# Altium project LLN-24VDimmer.PrjPcb
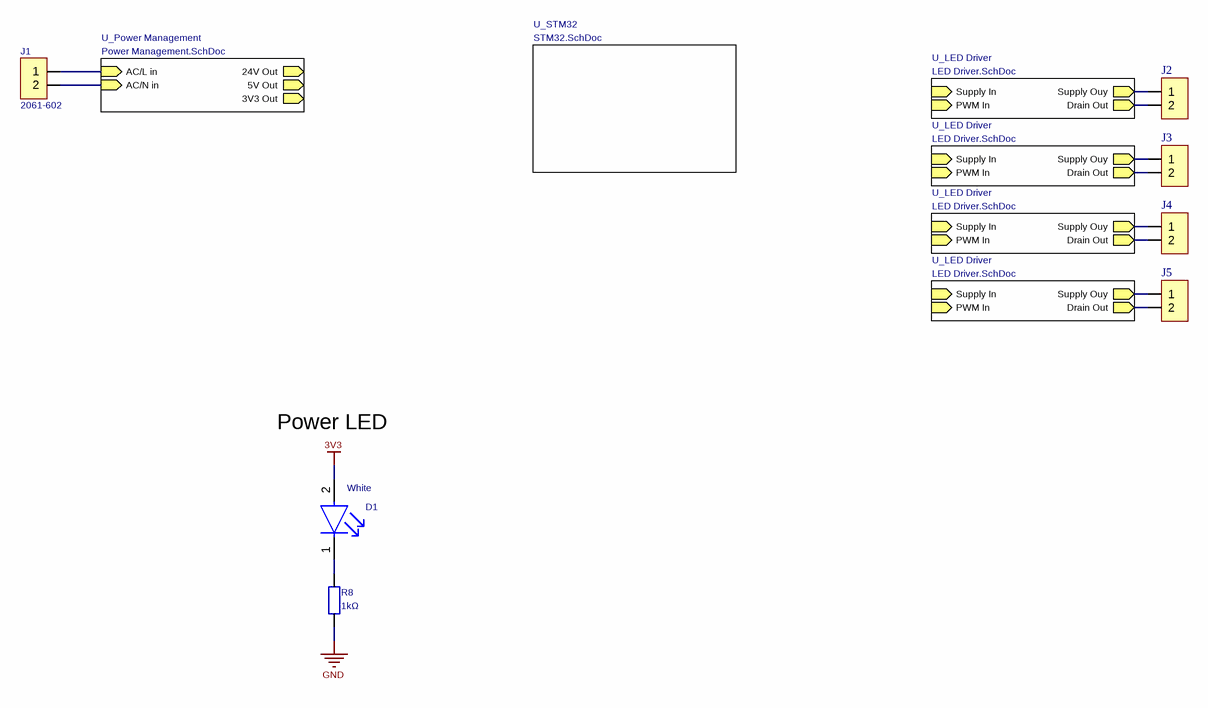
[diagram p0: LLN-24VDimmer.SchDoc]
address1: Drachmeweg 111; address2: 2153PA Nieuw-Vennep; CompanyName: Mayht; DrawnBy: David; HWRev: 0.9.0; Project: Mayhtier V0.9.0
4 sheets, 79 parts. Net scope: hierarchical (ports join the sheet entries above them; power ports are global).
Board file: LLN-24VDimmer.PcbDoc
Sheets:
  LLN-24VDimmer.SchDoc
    U_STM32 = STM32.SchDoc
    U_Power Management = Power Management.SchDoc
    U_LED Driver = LED Driver.SchDoc
    U_LED Driver = LED Driver.SchDoc
    U_LED Driver = LED Driver.SchDoc
    U_LED Driver = LED Driver.SchDoc

## Sheet LLN-24VDimmer.SchDoc: Overview
size A3; CompanyName: Mayht; DrawnBy: David; Organization: Mayht; Address1: Drachmeweg 111; Address2: 2153PA Nieuw-Vennep; DocumentNumber: 1; Revision: 1.0; SheetNumber: 1; SheetTotal: 4

### Parts
(Parts that share a designator on the sheet are numbered #1, #2 ... from top to bottom, then left to right.)
D1#1  value White  [LEDC1608X08N]
J1  MPN: 2061-602  [WAGO_2061-602/998-404]
J2  (no value)  [WAGO_2060-452/998-404]
J3  (no value)  [WAGO_2060-452/998-404]
J4  (no value)  [WAGO_2060-452/998-404]
J5  (no value)  [WAGO_2060-452/998-404]
R8  value 1kΩ  [RESC1005X04N]

### Sub-sheets
U_LED Driver = LED Driver.SchDoc: PWM In (in), Drain Out (out), Supply Ouy (out), Supply In (in)
U_LED Driver = LED Driver.SchDoc: PWM In (in), Drain Out (out), Supply Ouy (out), Supply In (in)
U_LED Driver = LED Driver.SchDoc: PWM In (in), Drain Out (out), Supply Ouy (out), Supply In (in)
U_LED Driver = LED Driver.SchDoc: PWM In (in), Drain Out (out), Supply Ouy (out), Supply In (in)
U_Power Management = Power Management.SchDoc: 5V Out (out), 3V3 Out (out), 24V Out (out), AC/L in (in), AC/N in (in)
U_STM32 = STM32.SchDoc: no entries

### Nets
3V3: D1#1.2(A)
GND: R8.2
NetC1_U_LED_Driver#1_2: J2.1 ; sheet U_LED Driver/Supply Ouy
NetC1_U_LED_Driver#2_2: J3.1 ; sheet U_LED Driver/Supply Ouy
NetC1_U_LED_Driver#3_2: J4.1 ; sheet U_LED Driver/Supply Ouy
NetC1_U_LED_Driver#4_2: J5.1 ; sheet U_LED Driver/Supply Ouy
NetD1#1_1: D1#1.1(C) R8.1
NetD5_U_LED_Driver#1_1: J2.2 ; sheet U_LED Driver/Drain Out
NetD5_U_LED_Driver#2_1: J3.2 ; sheet U_LED Driver/Drain Out
NetD5_U_LED_Driver#3_1: J4.2 ; sheet U_LED Driver/Drain Out
NetD5_U_LED_Driver#4_1: J5.2 ; sheet U_LED Driver/Drain Out
NetF4_1: J1.1 ; sheet U_Power Management/AC/L in
NetJ1_2: J1.2 ; sheet U_Power Management/AC/N in

### Notes on the sheet
- Power LED
- Redako
- Keilestraat 5a, 3029BP, Rotterdam, M: david@redako.nl, T: +31 6 16001008
- Project
- Title
- Customer
- Size:
- Date:
- File:
- A4
- Revision:
- Time:
- Drawn by:
- GIT Revision:
- Sheet:
- of

### Library data of the parts
D1#1 = CMP-22017-000005-1: LED; MPN: KT-0603W; Package: 0603
J1-J5 = JST_Connector_2Pin
R8 = Res: MPN: 0402WGF1001TCE; Package: 0402

## Sheet STM32.SchDoc: STM32
size A3; CompanyName: Mayht; DrawnBy: David; Organization: Mayht; Address1: Drachmeweg 111; Address2: 2153PA Nieuw-Vennep; DocumentNumber: 18; Revision: 1.0; SheetNumber: 3; SheetTotal: 4
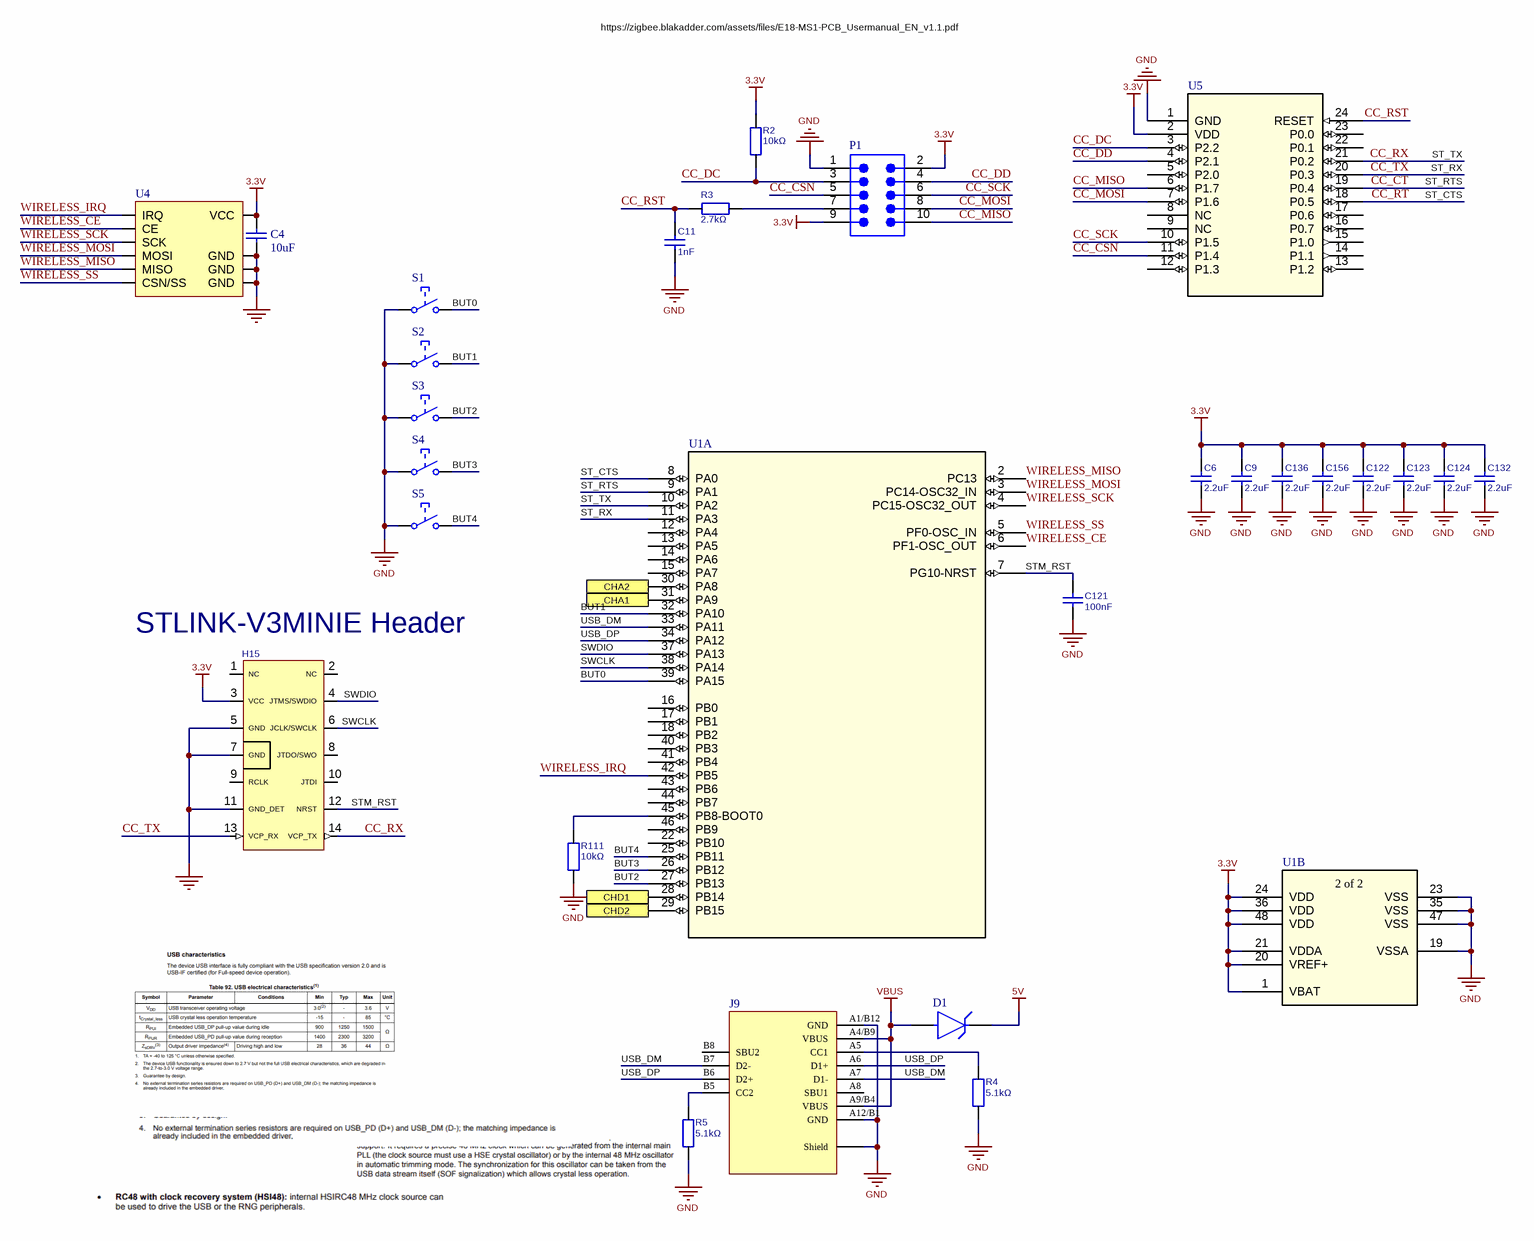
[diagram p1: STM32.SchDoc]

### Parts
(Parts that share a designator on the sheet are numbered #1, #2 ... from top to bottom, then left to right.)
C4  value 10uF  [CAPC1608X08N]
C6  value 2.2uF  [CAPC1005X05N]
C9  value 2.2uF  [CAPC1005X05N]
C11  value 1nF  [CAPC1005X05N]
C121  value 100nF  [CAPC1005X05N]
C122  value 2.2uF  [CAPC1005X05N]
C123  value 2.2uF  [CAPC1005X05N]
C124  value 2.2uF  [CAPC1005X05N]
C132  value 2.2uF  [CAPC1005X05N]
C136  value 2.2uF  [CAPC1005X05N]
C156  value 2.2uF  [CAPC1005X05N]
D1#2  (no value)  [SOD123]
H15  (no value)  [Header 2x7 [14] 1.27mm Male TH]
J9  (no value)  [USB4105-GF-A-Footprint-1]
P1  (no value)  [62201021121]
R2  value 10kΩ  [RESC1005X04N]
R3  value 2.7kΩ  [RESC1005X04N]
R4  value 5.1kΩ  [RESC1005X04N]
R5  value 5.1kΩ  [RESC1005X04N]
R111  value 10kΩ  [RESC1005X04N]
S1  (no value)  [SWITCH - 4x3 SMD - 2 pin]
S2  (no value)  [SWITCH - 4x3 SMD - 2 pin]
S3  (no value)  [SWITCH - 4x3 SMD - 2 pin]
S4  (no value)  [SWITCH - 4x3 SMD - 2 pin]
S5  (no value)  [SWITCH - 4x3 SMD - 2 pin]
U1  (no value)  [LQFP48-7x7mm]  (parts A,B of 2)
U4  (no value)  [E01-2G4M13S]
U5  (no value)  [E18-MS1-PCB_BYT]

### Ports
CHA1 (out), CHA2 (out), CHD1 (out), CHD2 (out)

### Nets
3.3V: C4.1 C6.2 C9.2 C122.2 C123.2 C124.2 C132.2 C136.2 C156.2 H15.3(VCC) P1.2 P1.9 R2.1 U1.1(VBAT) U1.20(VREF+) U1.21(VDDA) U1.24(VDD) U1.36(VDD) U1.48(VDD) U4.1(VCC) U5.2(VDD)
5V: D1#2.2(C)
GND: C4.2 C6.1 C9.1 C11.1 C121.1 C122.1 C123.1 C124.1 C132.1 C136.1 C156.1 H15.5(GND) H15.7(GND) H15.11(GND_DET) J9.A1/B12(GND) J9.A12/B1(GND) J9.MNT(Shield) P1.1 R4.2 R5.2 R111.2 S1.1 S2.1 S3.1 S4.1 S5.1 U1.19(VSSA) U1.23(VSS) U1.35(VSS) U1.47(VSS) U4.8(GND) U4.9(GND) U4.10(GND) U5.1(GND)
VBUS: D1#2.1(A) J9.A4/B9(VBUS) J9.A9/B4(VBUS)
BUT0: S1.2 U1.39(PA15)
BUT1: S2.2 U1.32(PA10)
BUT2: S3.2 U1.27(PB13)
BUT3: S4.2 U1.26(PB12)
BUT4: S5.2 U1.25(PB11)
CC_CSN: P1.5 U5.11(P1.4)
CC_CT: U1.9(PA1) U5.19(P0.4)  [also labelled ST_RTS]
CC_DC: P1.3 R2.2 U5.3(P2.2)
CC_DD: P1.4 U5.4(P2.1)
CC_MISO: P1.10 U5.6(P1.7)
CC_MOSI: P1.8 U5.7(P1.6)
CC_RST: C11.2 R3.2 U5.24(RESET)
CC_RT: U1.8(PA0) U5.18(P0.5)  [also labelled ST_CTS]
CC_RX: H15.14(VCP_TX) U1.10(PA2) U5.21(P0.2)  [also labelled ST_TX]
CC_SCK: P1.6 U5.10(P1.5)
CC_TX: H15.13(VCP_RX) U1.11(PA3) U5.20(P0.3)  [also labelled ST_RX]
STM_RST: C121.2 H15.12(NRST) U1.7(PG10-NRST)
SWCLK: H15.6(JCLK/SWCLK) U1.38(PA14)
SWDIO: H15.4(JTMS/SWDIO) U1.37(PA13)
USB_DM: J9.A7(D1-) J9.B7(D2-) U1.33(PA11)
USB_DP: J9.A6(D1+) J9.B6(D2+) U1.34(PA12)
WIRELESS_CE: U1.6(PF1-OSC_OUT) U4.2(CE)
WIRELESS_IRQ: U1.42(PB5) U4.7(IRQ)
WIRELESS_MISO: U1.2(PC13) U4.6(MISO)
WIRELESS_MOSI: U1.3(PC14-OSC32_IN) U4.5(MOSI)
WIRELESS_SCK: U1.4(PC15-OSC32_OUT) U4.4(SCK)
WIRELESS_SS: U1.5(PF0-OSC_IN) U4.3(CSN/SS)
NetJ9_A5: J9.A5(CC1) R4.1
NetJ9_B5: J9.B5(CC2) R5.1
NetP1_7: P1.7 R3.1
NetR111_1: R111.1 U1.45(PB8-BOOT0)
NetU1_28: U1.28(PB14) ; port CHD1
NetU1_29: U1.29(PB15) ; port CHD2
NetU1_30: U1.30(PA8) ; port CHA2
NetU1_31: U1.31(PA9) ; port CHA1

Not connected (* = marked no-connect by the designer): H15 1(NC) 2(NC) 8(JTDO/SWO) 9(RCLK) 10(JTDI); J9 A8(SBU1) B8(SBU2); U1 12(PA4) 13(PA5) 14(PA6) 15(PA7) 16(PB0) 17(PB1) 18(PB2) 22(PB10) 40(PB3) 41(PB4) 43(PB6) 44(PB7) 46(PB9); U5 5(P2.0) 8(NC) 9(NC) 12(P1.3) 13(P1.2) 14(P1.1) 15(P1.0) 16(P0.7) 17(P0.6) 22(P0.1) 23(P0.0)

### Notes on the sheet
- https://zigbee.blakadder.com/assets/files/E18-MS1-PCB_Usermanual_EN_v1.1.pdf
- (near H15) STLINK-V3MINIE Header
- Redako
- Keilestraat 5a, 3029BP, Rotterdam, M: david@redako.nl, T: +31 6 16001008
- Project
- Title
- Customer
- Size:
- Date:
- File:
- A4
- Revision:
- Time:
- Drawn by:
- GIT Revision:
- Sheet:
- of
- (in symbol STM32G474CBT6TR, part B) 2 of 2

### Library data of the parts
C4 C6 C9 C11 C122-C124 C132 C136 C156 = SMD_Cap
  C4: Package: 0603
  C6 C9 C11 C122-C124 C132 C136 C156: Package: 0402
C121 = SMD_Cap: Manufacturer: Samsung; MPN: CL05B104KB54PNC; Type: X7R; Rating: 50V; Tolerance: ±10%; Package: 0402; JLC Part Type: Basic; JLCPCB Part #: C307331
D1#2 = f813f71cba58e380607f5dd3caf9714: BZT52C20-7-F BZT52C20 Series 20 V 10 mA 500 mW Surface Mount Zener Diode - SOD-123; MPN: B5819W SL; Package: SOD-123; JLCPCB Part #: C8598
H15 = STLINK-V3MINIE_14P_TH: MPN: DW127R-22-14-23
J9 = USB C USB4105-GF-A-120: Manufacturer: Sofng; MPN: MC-311D; Package: SMD; JLCPCB Part #: C136423
P1 = CMP-1502-00948-3: MPN: 1271WV-2x5P
R2 R111 = Res: MPN: 0402WGF1002TCE; Manufacturer: Uniroyal; Rating: 50V; Tolerance: ±1%; Package: 0402; JLC Part Type: Basic; JLCPCB Part #: C25744
R3-R5 = Res: Manufacturer: Uniroyal; Rating: 50V; Tolerance: ±1%; Package: 0402
S1-S5 = TS-1088R-02026: SPST 50MA @ 12VDC VERTICAL ROUND BUTTON 260GF SMD,3X4X2.0MM TACTILE SWITCHES ROHS; Manufacturer: XUNPU; Value: 50mA, 12VDC; MPN: TS-1088R-02026; Package: SMD,3x4x2.0mm; JLC Part Type: Extended; JLCPCB Part #: C455280
U1 = STM32G474CBT6TR: No Description Available; MPN: STM32G474CBT6TR
U4 = E01-ML01SP4: MPN: E01-2G4M13S
U5 = E18-MS1-PCB: No Description Available; MPN: E18-MS1-PCB

## Sheet Power Management.SchDoc: Power Management
size 287 x 198 mm; CompanyName: Mayht; DrawnBy: David; Organization: Mayht; Address1: Drachmeweg 111; Address2: 2153PA Nieuw-Vennep; DocumentNumber: 1; Revision: 1.0; SheetNumber: 2; SheetTotal: 4
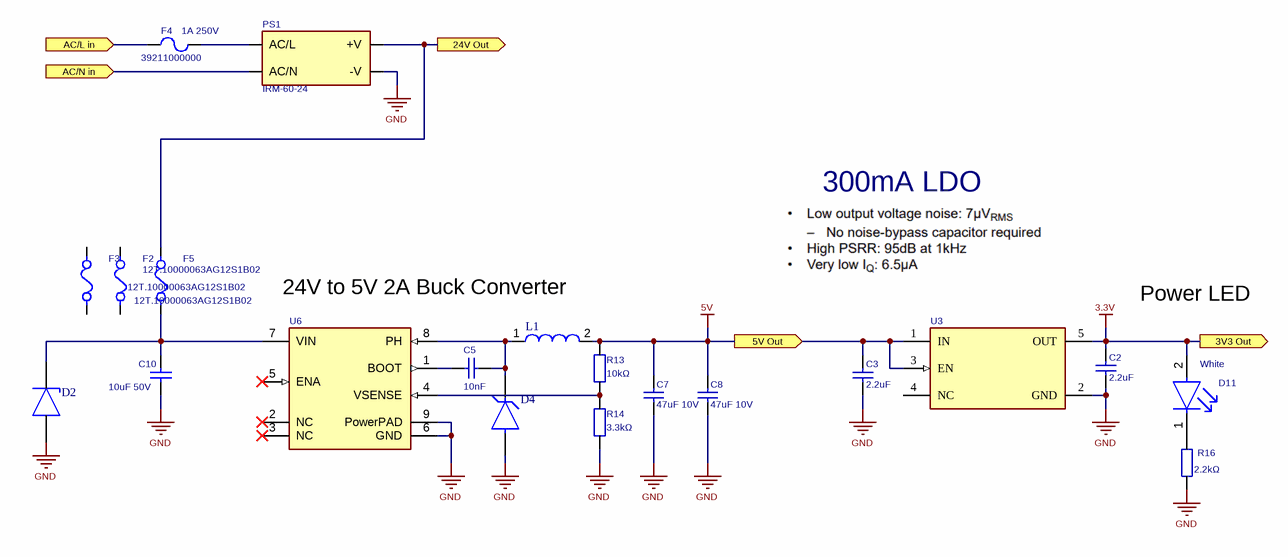
[diagram p2: Power Management.SchDoc]

### Parts
C2  value 2.2uF  [CAPC1005X05N]
C3  value 2.2uF  [CAPC1005X05N]
C5  value 10nF  [CAPC1005X05N]
C7  value 47uF 10V  [CAPC3216X16N]
C8  value 47uF 10V  [CAPC3216X16N]
C10  value 10uF 50V  [CAPC3216X16N]
D2  (no value)  [SOD-123FL]
D4  (no value)  [SOD-123]
D11  value White  [LEDC1608X08N]
F2  MPN: 12T.10000063AG12S1B02  [FP-SF-1206S-IPC_B]
F3  MPN: 12T.10000063AG12S1B02  [FP-SF-1206S-IPC_B]
F4  value 1A 250V  MPN: 39211000000  [FUS_LITTELFUSE_392_LTF]
F5  MPN: 12T.10000063AG12S1B02  [FP-SF-1206S-IPC_B]
L1  (no value)  [SWPA6054A]
PS1  (no value)  [IRM-60-24]
R13  value 10kΩ  [RESC1005X04N]
R14  value 3.3kΩ  [RESC1005X04N]
R16  value 2.2kΩ  [RESC1005X04N]
U3  (no value)  [FP-DBV0005A-MFG]
U6  (no value)  [FP-DDA0008J-MFG]

### Ports
3V3 Out (out), 5V Out (out), 24V Out (out), AC/L in (in), AC/N in (in)

### Nets
3.3V: C2.2 D11.2(A) U3.5(OUT) ; port 3V3 Out
5V: C3.2 C7.1 C8.1 L1.2 R13.1 U3.1(IN) U3.3(EN) ; port 5V Out
GND: C2.1 C3.1 C7.2 C8.2 C10.1 D2.1(A) D4.A PS1.-V R14.2 R16.2 U3.2(GND) U6.6(GND) U6.9(PowerPAD)
NetC5_1: C5.1 U6.1(BOOT)
NetC5_2: C5.2 D4.K(C) L1.1 U6.8(PH)
NetC10_2: C10.2 D2.2(C) F5.1 U6.7(VIN)
NetD11_1: D11.1(C) R16.1
NetF4_1: F4.1 ; port AC/L in
NetF4_2: F4.2 PS1.AC/L
NetF5_2: F5.2 PS1.+V ; port 24V Out
NetJ1_2: PS1.AC/N ; port AC/N in
NetR13_2: R13.2 R14.1 U6.4(VSENSE)

Not connected (* = marked no-connect by the designer): F2 1 2; F3 1 2; U3 4(NC); U6 2(NC)* 3(NC)* 5(ENA)*

### Notes on the sheet
- 300mA LDO
- 24V to 5V 2A Buck Converter
- Power LED
- Redako
- Keilestraat 5a, 3029BP, Rotterdam, M: david@redako.nl, T: +31 6 16001008
- Project
- Title
- Customer
- Size:
- Date:
- File:
- A4
- Revision:
- Time:
- Drawn by:
- GIT Revision:
- Sheet:
- of

### Library data of the parts
C2 C3 C5 = SMD_Cap: Package: 0402
C7 C8 = SMD_Cap: Rating: 10V; Package: 1206
C10 = CMP-2000-06048-1: Rating: 50V; Package: 1206
D2 = d386f69c7d770905792c16b93fa31a7: SMF24A-E3-08 Trans Voltage Suppressor Diode, 1000W, 24V V(RWM), Unidirectional, 1 Element, Silicon, DO-219AB; MPN: SMF24A
D4 = f813f71cba58e380607f5dd3caf9714: as D1#2 on sheet STM32; Package: SOD-123; JLCPCB Part #: C8598
D11 = CMP-22017-000005-1: LED; Package: 0603
F2 F3 F5 = CMP-07399-000003-1: FUSE BOARD MOUNT 1A 63VDC 1206; Package: 1206
F4 = FUSE-2: Manufacturer: Littelfuse; JLC Part Type: Extended; JLCPCB Part #: C99566
L1 = SWPA6045S101MT: 100uH ±20% 800mA 433mΩ SMD,6.0x6.0x4.5mm Power Inductors RoHS; MPN: SWPA6045S101MT; Package: SMD,6.0x6.0x4.5mm; JLC Part Type: Extended; JLCPCB Part #: C60633
PS1 = IRM-60-24: Enclosed AC DC Converters 1 Uitgang 24V 2.5A 85 ~ 264 VAC Input; Package: DIP-4 Mean Well; Value: 24V; MPN: IRM-60-24
R13 R14 R16 = Res: Package: 0402
U3 = CMP-04917-000300-1: IC REG LINEAR 3.3V 300MA SOT23-5; MPN: TPS7A2033PDBVR
U6 = CMP-2000-04960-2: IC REG BUCK ADJUSTABLE 3A 8SOPWR; Manufacturer: Texas Instruments; MPN: TPS5430DDAR; Package: LSOP-8; JLCPCB Part #: C9864

## Sheet LED Driver.SchDoc
size 287 x 198 mm; SheetNumber: 4; SheetTotal: 4
Used 4 times, as channels U_LED Driver, U_LED Driver, U_LED Driver, U_LED Driver. Parts and nets are listed once, with the designators drawn on the sheet.
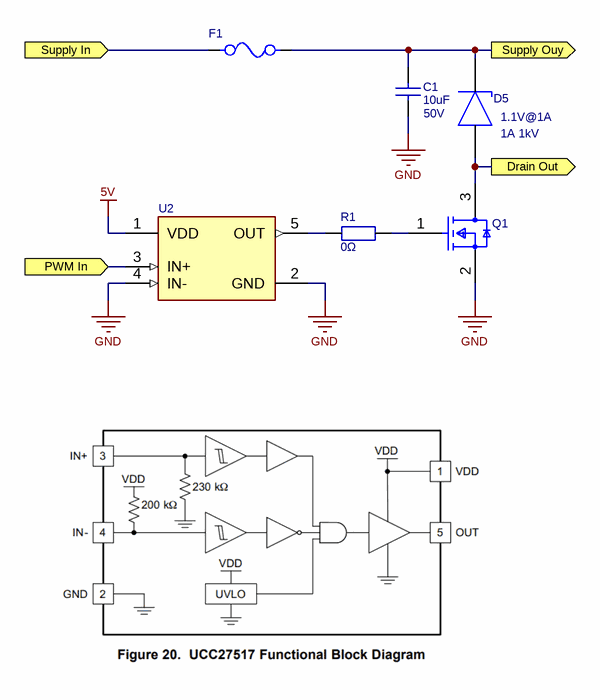
[diagram p3: LED Driver.SchDoc]

### Parts
C1  value 10uF  Rating: 50V  [CAPC3225X20N]
D5  value 1.1V@1A  Rating: 1A 1kV  [sod-123FL]
F1  (no value)  [FP-0685T-IPC_C]
Q1  (no value)  [SOT95P245X110-3N]
R1  value 0Ω  [RESC1005X04N]
U2  (no value)  [FP-DBV0005A-MFG]

### Ports
Drain Out (out), PWM In (in), Supply In (in), Supply Ouy (out)

### Nets
5V: U2.1(VDD)
GND: C1.1 Q1.2(S) U2.2(GND) U2.4(IN-)
Drain Out: D5.1(A) Q1.3(D) ; port Drain Out
PWM In: U2.3(IN+) ; port PWM In
Supply In: F1.1 ; port Supply In
Supply Ouy: C1.2 D5.2(C) F1.2 ; port Supply Ouy
NetQ1_1: Q1.1(G) R1.2
NetR1_1: R1.1 U2.5(OUT)

### Channels
U_LED Driver: designators end in _U_LED_Driver#1; ports Drain Out=NetD5_U_LED_Driver#1_1 PWM In=NetU2_U_LED_Driver#1_3 Supply In=NetF1_U_LED_Driver#1_1 Supply Ouy=NetC1_U_LED_Driver#1_2
U_LED Driver: designators end in _U_LED_Driver#2; ports Drain Out=NetD5_U_LED_Driver#2_1 PWM In=NetU2_U_LED_Driver#2_3 Supply In=NetF1_U_LED_Driver#2_1 Supply Ouy=NetC1_U_LED_Driver#2_2
U_LED Driver: designators end in _U_LED_Driver#3; ports Drain Out=NetD5_U_LED_Driver#3_1 PWM In=NetU2_U_LED_Driver#3_3 Supply In=NetF1_U_LED_Driver#3_1 Supply Ouy=NetC1_U_LED_Driver#3_2
U_LED Driver: designators end in _U_LED_Driver#4; ports Drain Out=NetD5_U_LED_Driver#4_1 PWM In=NetU2_U_LED_Driver#4_3 Supply In=NetF1_U_LED_Driver#4_1 Supply Ouy=NetC1_U_LED_Driver#4_2

### Notes on the sheet
- Redako
- Keilestraat 5a, 3029BP, Rotterdam, M: david@redako.nl, T: +31 6 16001008
- Project
- Title
- Customer
- Size:
- Date:
- File:
- A4
- Revision:
- Time:
- Drawn by:
- GIT Revision:
- Sheet:
- of

### Library data of the parts
C1 = SMD_Cap: Package: 1210
D5 = d386f69c7d770905792c16b93fa31a7: 1A Independent Type 1kV 1.1V@1A SOD-123FL Diodes; MPN: SM4007PL
F1 = CMP-16042-000018-1: FUSE 3.0A 63VAC/DC SLOW 1206; MPN: 0468003.NRHF
Q1 = AO3400A: N-Channel 30V 5.7A 1.5V @ 250uA 26.5mΩ @ 5.7A,10V 1.4W SOT-23-3L MOSFET RoHS; Manufacturer: Alpha & Omega Semicon; Value: 5.7A @ 10V; MPN: AO3400A; Package: SOT-23-3L; JLC Part Type: Basic; JLCPCB Part #: C20917
R1 = Res: Package: 0402
U2 = CMP-04912-000015-1: IC GATE DVR LOW SIDE 1CH SOT23-5; Manufacturer: Texas Instruments; MPN: UCC27517DBVR; Package: DBV0005A

## Nets that join several sheets
3.3V: STM32 (21 pins), Power Management (C2.2 D11.2 U3.5)
5V: STM32 (D1#2.2), Power Management (7 pins), U_LED Driver (U2_U_LED_Driver#1.1), U_LED Driver (U2_U_LED_Driver#2.1), U_LED Driver (U2_U_LED_Driver#3.1), U_LED Driver (U2_U_LED_Driver#4.1)
GND: LLN-24VDimmer (R8.2), STM32 (34 pins), Power Management (13 pins), U_LED Driver (C1_U_LED_Driver#1.1 Q1_U_LED_Driver#1.2 U2_U_LED_Driver#1.2 U2_U_LED_Driver#1.4), U_LED Driver (C1_U_LED_Driver#2.1 Q1_U_LED_Driver#2.2 U2_U_LED_Driver#2.2 U2_U_LED_Driver#2.4), U_LED Driver (C1_U_LED_Driver#3.1 Q1_U_LED_Driver#3.2 U2_U_LED_Driver#3.2 U2_U_LED_Driver#3.4), U_LED Driver (C1_U_LED_Driver#4.1 Q1_U_LED_Driver#4.2 U2_U_LED_Driver#4.2 U2_U_LED_Driver#4.4)
NetC1_U_LED_Driver#1_2: LLN-24VDimmer (J2.1), U_LED Driver (C1_U_LED_Driver#1.2 D5_U_LED_Driver#1.2 F1_U_LED_Driver#1.2)
NetC1_U_LED_Driver#2_2: LLN-24VDimmer (J3.1), U_LED Driver (C1_U_LED_Driver#2.2 D5_U_LED_Driver#2.2 F1_U_LED_Driver#2.2)
NetC1_U_LED_Driver#3_2: LLN-24VDimmer (J4.1), U_LED Driver (C1_U_LED_Driver#3.2 D5_U_LED_Driver#3.2 F1_U_LED_Driver#3.2)
NetC1_U_LED_Driver#4_2: LLN-24VDimmer (J5.1), U_LED Driver (C1_U_LED_Driver#4.2 D5_U_LED_Driver#4.2 F1_U_LED_Driver#4.2)
NetD5_U_LED_Driver#1_1: LLN-24VDimmer (J2.2), U_LED Driver (D5_U_LED_Driver#1.1 Q1_U_LED_Driver#1.3)
NetD5_U_LED_Driver#2_1: LLN-24VDimmer (J3.2), U_LED Driver (D5_U_LED_Driver#2.1 Q1_U_LED_Driver#2.3)
NetD5_U_LED_Driver#3_1: LLN-24VDimmer (J4.2), U_LED Driver (D5_U_LED_Driver#3.1 Q1_U_LED_Driver#3.3)
NetD5_U_LED_Driver#4_1: LLN-24VDimmer (J5.2), U_LED Driver (D5_U_LED_Driver#4.1 Q1_U_LED_Driver#4.3)
NetF4_1: LLN-24VDimmer (J1.1), Power Management (F4.1)
NetJ1_2: LLN-24VDimmer (J1.2), Power Management (PS1.AC/N)

## Assembly variants
Default: not fitted H1 H5 H6 H7
MVP: all parts fitted